# Altium schematic sheet Block Diagram.SchDoc: Melon S3 FPGA
size A4; Organization: Q-Wave Systems Co.,Ltd; ProjectName: Melon S3
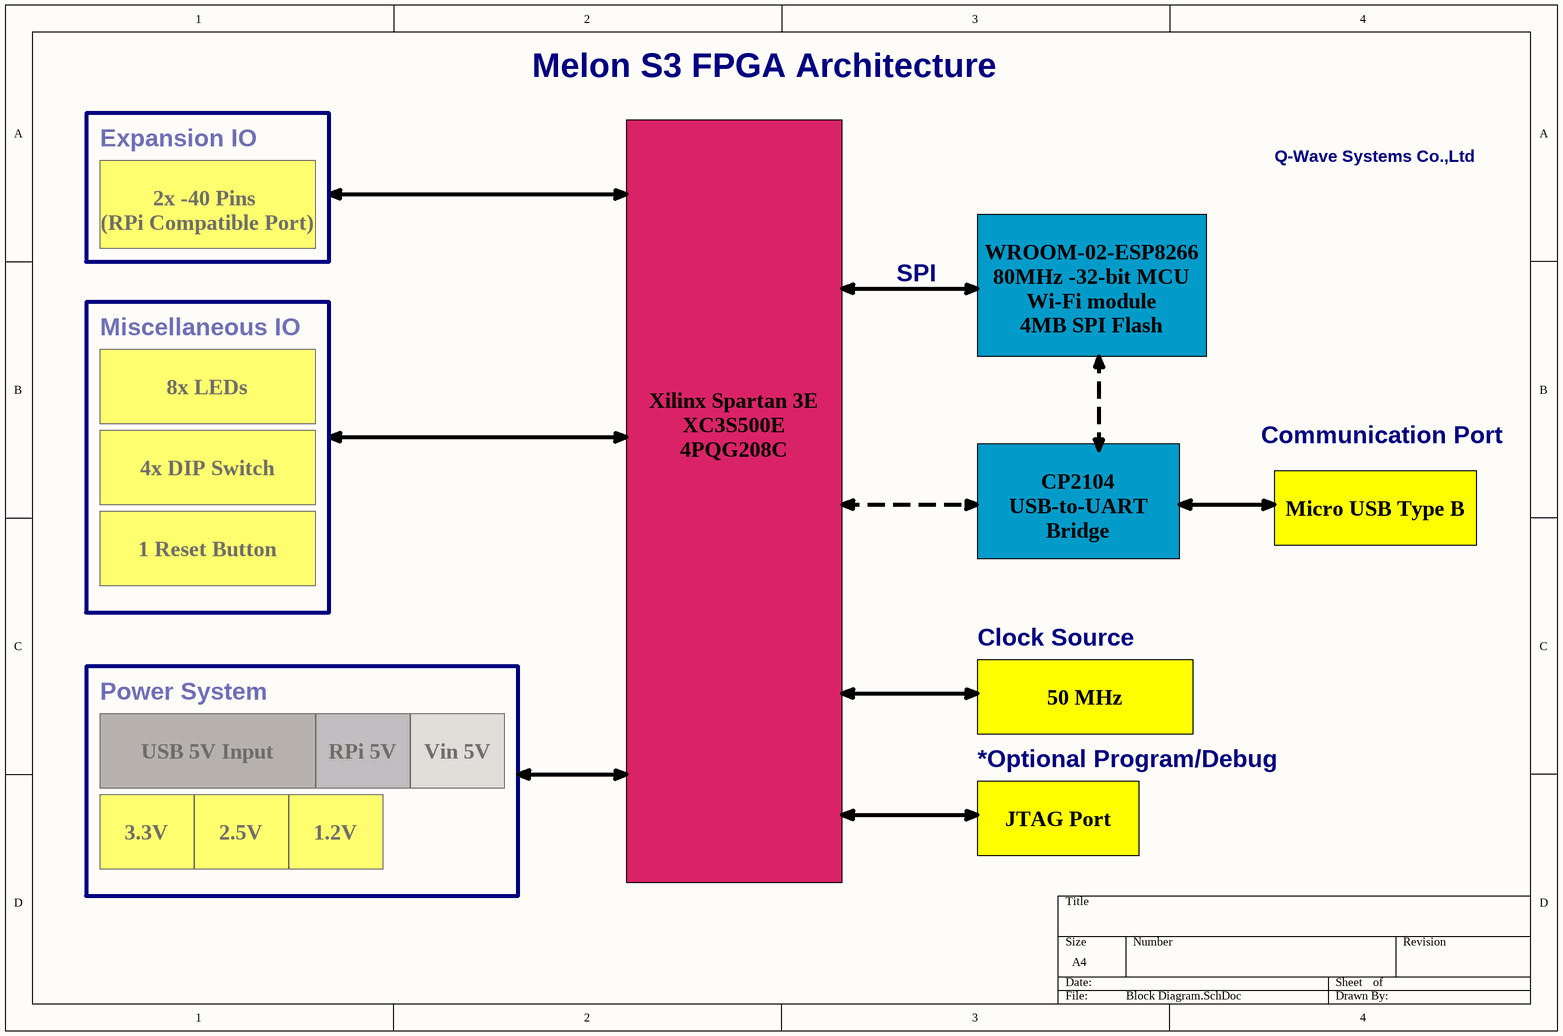
[diagram p0: Block Diagram.SchDoc]

## Notes on the sheet
- Melon S3 FPGA Architecture
- Expansion IO
- Q-Wave Systems Co.,Ltd
- 2x -40 Pins
  (RPi Compatible Port)
- SPI
- Miscellaneous IO
- WROOM-02-ESP8266
  80MHz -32-bit MCU Wi-Fi module
  4MB SPI Flash
- 8x LEDs
- Communication Port
- 4x DIP Switch
- 1 Reset Button
- CP2104
  USB-to-UART Bridge
- Micro USB Type B
- Clock Source
- Power System
- USB 5V Input
- RPi 5V
- Vin 5V
- 50 MHz
- *Optional Program/Debug
- JTAG Port
- 3.3V
- 2.5V
- 1.2V
- Xilinx Spartan 3E
  XC3S500E
  4PQG208C